# Altium schematic sheet VREG RT9166-25PVL with EN.SchDoc
size 129 x 69 mm
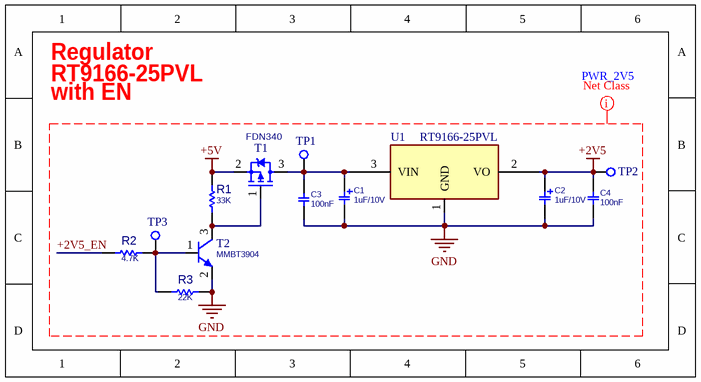
[diagram p0: VREG RT9166-25PVL with EN.SchDoc]

## Parts
C1  1uF/10V  [C_TN_A]
C2  1uF/10V  [C_TN_A]
C3  100nF  [C0603S]
C4  100nF  [C0603S]
R1  33K  [R0603S]
R2  4.7K  [R0603S]
R3  22K  [R0603S]
T1  FDN340  [SOT23_3]
T2  MMBT3904  [SOT23_3]
TP1  Test Point  [TPSMD_C1]  (value not drawn)
TP2  Test Point  [TPSMD_C1]  (value not drawn)
TP3  Test Point  [TPSMD_C1]  (value not drawn)
U1  RT9166-25PVL  [SOT23_3]

## Nets
+2V5: C2.1 C4.1 TP2.1(TP) U1.2(VO)
+5V: R1.2 T1.2(S)
GND: C1.2 C2.2 C3.2 C4.2 R3.1 T2.2(E) U1.1(GND)
+2V5_EN: R2.2
NetC1_1: C1.1 C3.1 T1.3(D) TP1.1(TP) U1.3(VIN)
NetR1_1: R1.1 T1.1(G) T2.3(C)
NetR2_1: R2.1 R3.2 T2.1(B) TP3.1(TP)

## Layout directives
net class PWR_2V5: +2V5, +2V5_EN, +5V, GND

## Notes on the sheet
- Regulator
- RT9166-25PVL
- with EN
- PWR_2V5

## Library data of the parts
C1 C2 = CAP_SMD_TAN: CAP, SMD, TAN; PARAM: 10V; VALUE: 1uF/10V
C3 C4 = CAP_SMD_MLCC: CAP, SMD, MLCC; PARAM: 50V; DESC: CAP, MLCC, 1nF, 50V, C0G, 10%, 0402; MANF_P#: MANF_PART#; MANF: Murata; PARAM2: C0G, 10%; PRICE: 100= 1$; ASSEMBLY: ASSEMBLY; VALUE: 100nF
R1-R3 = RES_SMD: RES, SMD; MANF_P#: RK73H1ETTP4701F; MANF: KOA SPEER; PARAM: 0.063W; DESC: DESCRIPTION; DIST#: MOUSER; PARAM2: 1%; ASSEMBLY: ASSEMBLY; PRICE: 100= 0.5$
  R1: VALUE: 33K
  R2: VALUE: 4.7K
  R3: VALUE: 22K
T1 = MOSP_FDN340_SOT23: MOSFET SMD P-CH 20V 2A; MANF_P#: FDN360; ASSEMBLY: ASSEMBLY; VALUE: FDN340
T2 = NPN_MMBT3904_SOT23: BJT, NPN, 40V, 0.2A, SMD, SOT23; PARAM2: 250mW; MANF: Diodes, NXP, FAIRCHILD, ON; PARAM: 40v, 0.2A; MANF_P#: MMBT3904; VALUE: MMBT3904
U1 = VREG_RT9166A-25PVL_SOT23: REG, Linear, Fixed, 2.5v, 0.3A/0.6A, SOT23; MANF: TI; PARAM: 2.5V, 0.3mA/06mA; MANF_P#: RT9166-25PVL; PARAM2: 2.5V; VALUE: RT9166-25PVL